# EAGLE design Low Pass Gate (EAGLE 9.2.2)
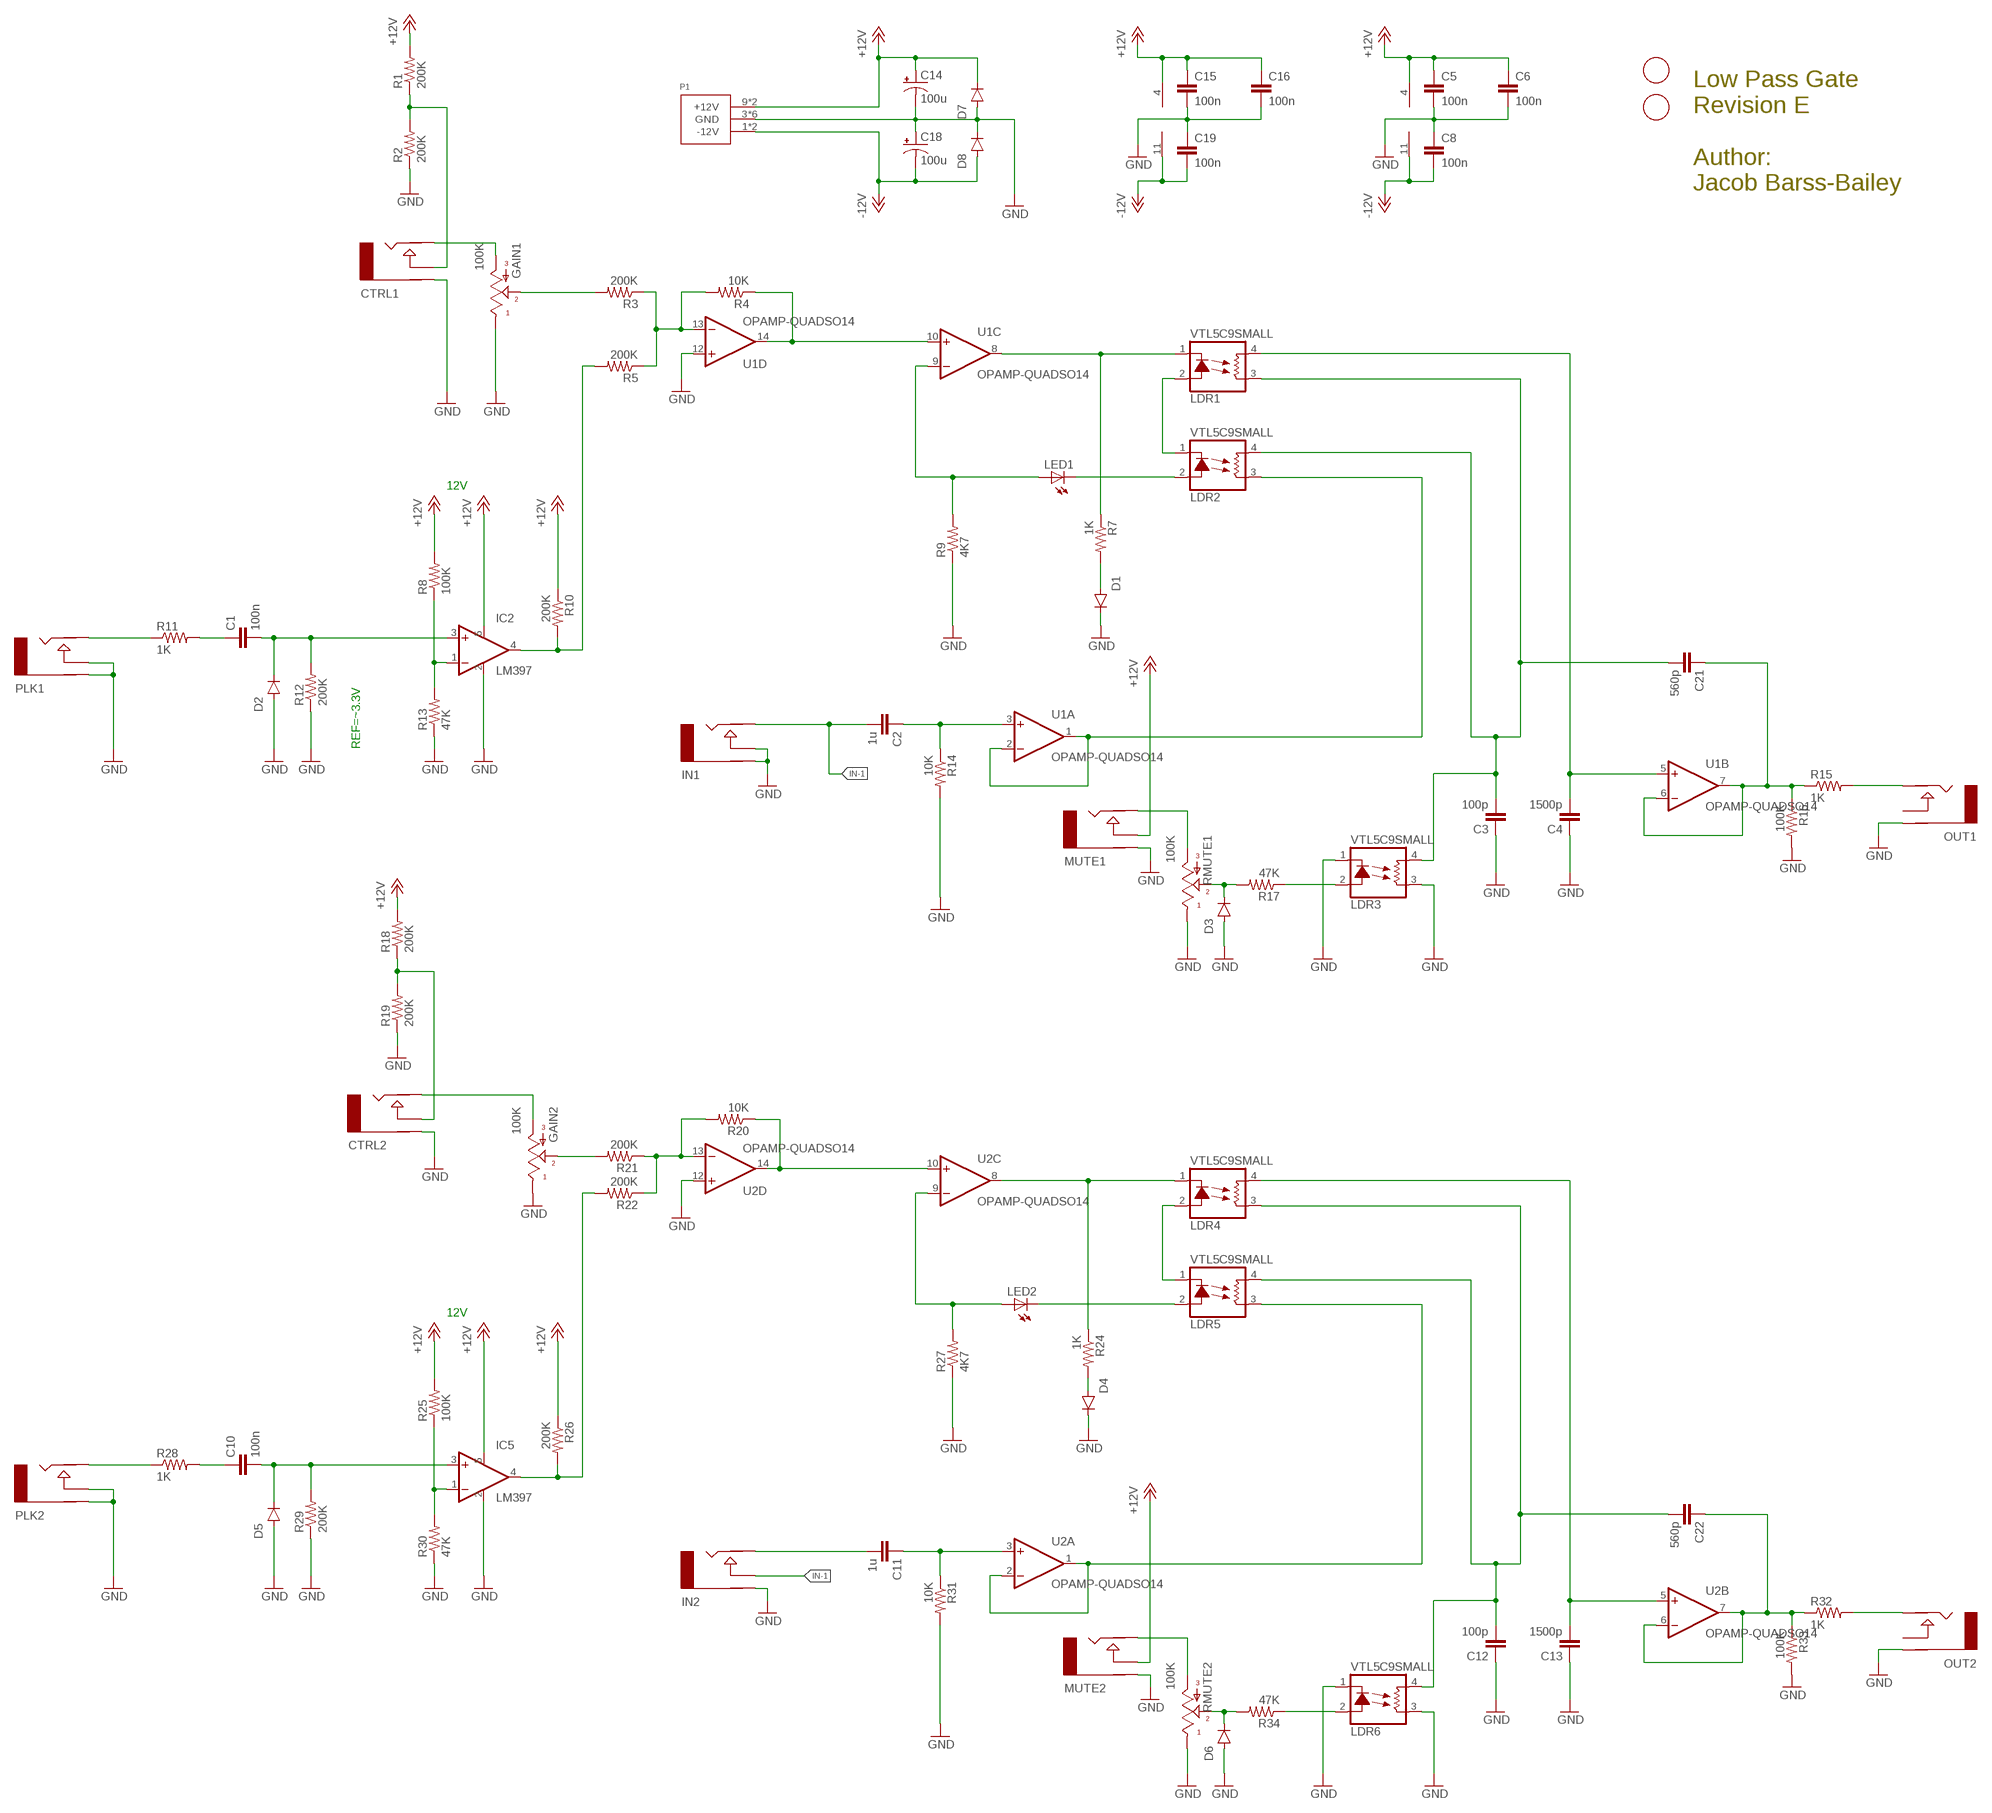
[diagram p0: schematic, sheet 1]

## Parts
C1  100n  CAP0805  [0805]
C2  1u  CAP0805  [0805]
C3  100p  CAP0805  [0805]
C4  1500p  CAP0805  [0805]
C5  100n  CAP0805  [0805]
C6  100n  CAP0805  [0805]
C8  100n  CAP0805  [0805]
C10  100n  CAP0805  [0805]
C11  1u  CAP0805  [0805]
C12  100p  CAP0805  [0805]
C13  1500p  CAP0805  [0805]
C14  100u  CAP_POLD  [PANASONIC_D]
C15  100n  CAP0805  [0805]
C16  100n  CAP0805  [0805]
C18  100u  CAP_POLD  [PANASONIC_D]
C19  100n  CAP0805  [0805]
C21  560p  CAP0805  [0805]
C22  560p  CAP0805  [0805]
CTRL1  AUDIO-JACKINLINE-FLOATGND  [ERTHENVAR-JACK-INLINE-SHAREGND550]
CTRL2  AUDIO-JACKINLINE-FLOATGND  [ERTHENVAR-JACK-INLINE-SHAREGND550]
D1  DIODE-SOD323-W  [SOD323-W]
D2  DIODE-SOD323-W  [SOD323-W]
D3  DIODE-SOD323-W  [SOD323-W]
D4  DIODE-SOD323-W  [SOD323-W]
D5  DIODE-SOD323-W  [SOD323-W]
D6  DIODE-SOD323-W  [SOD323-W]
D7  DIODE-SOD323-W  [SOD323-W]
D8  DIODE-SOD323-W  [SOD323-W]
GAIN1  100K  POTALPS-KIT  [ALPS_POT_KIT]
GAIN2  100K  POTALPS-KIT  [ALPS_POT_KIT]
IC2  LM397  [SOT23-5]
IC5  LM397  [SOT23-5]
IN1  AUDIO-JACKINLINE-FLOATGND  [ERTHENVAR-JACK-INLINE-SHAREGND550]
IN2  AUDIO-JACKINLINE-FLOATGND  [ERTHENVAR-JACK-INLINE-SHAREGND550]
LDR1  VTL5C9SMALL  [VTL5C-SMALL]
LDR2  VTL5C9SMALL  [VTL5C-SMALL]
LDR3  VTL5C9SMALL  [VTL5C-SMALL]
LDR4  VTL5C9SMALL  [VTL5C-SMALL]
LDR5  VTL5C9SMALL  [VTL5C-SMALL]
LDR6  VTL5C9SMALL  [VTL5C-SMALL]
LED1  LED3MM  [LED3MM]
LED2  LED3MM  [LED3MM]
MUTE1  AUDIO-JACKINLINE  [ERTHENVAR-JACK-INLINE]
MUTE2  AUDIO-JACKINLINE  [ERTHENVAR-JACK-INLINE]
OUT1  AUDIO-JACKINLINE  [ERTHENVAR-JACK-INLINE]
OUT2  AUDIO-JACKINLINE  [ERTHENVAR-JACK-INLINE]
P1  POWER_SIMPLE10_SHROUDED  [POWER_10_SHROUDED]
PLK1  AUDIO-JACKINLINE  [ERTHENVAR-JACK-INLINE]
PLK2  AUDIO-JACKINLINE  [ERTHENVAR-JACK-INLINE]
R1  200K  RESISTOR0603-RES  [0603-RES]
R2  200K  RESISTOR0603-RES  [0603-RES]
R3  200K  RESISTOR0603-RES  [0603-RES]
R4  10K  RESISTOR0603-RES  [0603-RES]
R5  200K  RESISTOR0603-RES  [0603-RES]
R7  1K  RESISTOR0603-RES  [0603-RES]
R8  100K  RESISTOR0603-RES  [0603-RES]
R9  4K7  RESISTOR0603-RES  [0603-RES]
R10  200K  RESISTOR0603-RES  [0603-RES]
R11  1K  RESISTOR0603-RES  [0603-RES]
R12  200K  RESISTOR0603-RES  [0603-RES]
R13  47K  RESISTOR0603-RES  [0603-RES]
R14  10K  RESISTOR0603-RES  [0603-RES]
R15  1K  RESISTOR0603-RES  [0603-RES]
R16  100K  RESISTOR0603-RES  [0603-RES]
R17  47K  RESISTOR0603-RES  [0603-RES]
R18  200K  RESISTOR0603-RES  [0603-RES]
R19  200K  RESISTOR0603-RES  [0603-RES]
R20  10K  RESISTOR0603-RES  [0603-RES]
R21  200K  RESISTOR0603-RES  [0603-RES]
R22  200K  RESISTOR0603-RES  [0603-RES]
R24  1K  RESISTOR0603-RES  [0603-RES]
R25  100K  RESISTOR0603-RES  [0603-RES]
R26  200K  RESISTOR0603-RES  [0603-RES]
R27  4K7  RESISTOR0603-RES  [0603-RES]
R28  1K  RESISTOR0603-RES  [0603-RES]
R29  200K  RESISTOR0603-RES  [0603-RES]
R30  47K  RESISTOR0603-RES  [0603-RES]
R31  10K  RESISTOR0603-RES  [0603-RES]
R32  1K  RESISTOR0603-RES  [0603-RES]
R33  100K  RESISTOR0603-RES  [0603-RES]
R34  47K  RESISTOR0603-RES  [0603-RES]
RMUTE1  100K  POTALPS-KIT  [ALPS_POT_KIT]
RMUTE2  100K  POTALPS-KIT  [ALPS_POT_KIT]
U1  OPAMP-QUADSO14  [SO14]
U2  OPAMP-QUADSO14  [SO14]
U$1  FIDUCIAL  [FIDUCIAL_1MM]
U$2  FIDUCIAL  [FIDUCIAL_1MM]

## Nets
+12V: C5.1 C6.1 C14.+ C15.1 C16.1 D7.C IC2.5(V+) IC5.5(V+) MUTE1.N(NORM) MUTE2.N(NORM) P1.9(+12V) P1.10(+12V) R1.2 R8.2 R10.1 R18.2 R25.2 R26.1 U1.4(PWR:VCC) U2.4(PWR:VCC)
-12V: C8.2 C18.- C19.2 D8.A P1.1(-12V) P1.2(-12V) U1.11(PWR:VEE) U2.11(PWR:VEE)
GND: C3.1 C4.1 C5.2 C6.2 C8.1 C12.1 C13.1 C14.- C15.2 C16.2 C18.+ C19.1 CTRL1.G(RING) CTRL2.G(RING) D1.C D2.A D3.A D4.C D5.A D6.A D7.A D8.C GAIN1.P$1(E) GAIN2.P$1(E) IC2.2(GND) IC5.2(GND) IN1.G(RING) IN1.N(NORM) IN2.G(RING) LDR3.1(C) LDR3.3(L1) LDR6.1(C) LDR6.3(L1) MUTE1.G(RING) MUTE2.G(RING) OUT1.G(RING) OUT2.G(RING) P1.3(GND) P1.4(GND) P1.5(GND) P1.6(GND) P1.7(GND) P1.8(GND) PLK1.G(RING) PLK1.N(NORM) PLK2.G(RING) PLK2.N(NORM) R2.1 R9.1 R12.1 R13.1 R14.2 R16.2 R19.1 R27.1 R29.1 R30.1 R31.2 R33.2 RMUTE1.P$1(E) RMUTE2.P$1(E) U1.12(D:+IN) U2.12(D:+IN)
IN-1: C2.2 IN1.T(TIP) IN2.N(NORM)
N$1: R20.2 R21.1 R22.1 U2.13(D:-IN)
N$2: LDR4.1(C) R24.1 U2.8(C:OUT)
N$3: LDR4.2(A) LDR5.1(C)
N$5: GAIN2.P$2(S) R21.2
N$6: LED2.A R27.2 U2.9(C:-IN)
N$7: LDR5.2(A) LED2.K(C)
N$8: CTRL2.N(NORM) R18.1 R19.2
N$9: CTRL1.T(TIP) GAIN1.P$3(A)
N$10: D4.A R24.2
N$11: CTRL2.T(TIP) GAIN2.P$3(A)
N$12: PLK2.T(TIP) R28.1
N$13: C11.2 IN2.T(TIP)
N$14: IC5.4(OUT) R22.2 R26.2
N$15: C10.2 D5.C IC5.3(+IN) R29.2
N$16: C10.1 R28.2
N$17: IC5.1(-IN) R25.1 R30.2
N$18: R3.1 R4.2 R5.1 U1.13(D:-IN)
N$20: CTRL1.N(NORM) R1.1 R2.2
N$21: IC2.4(OUT) R5.2 R10.2
N$22: D6.C R34.2 RMUTE2.P$2(S)
N$23: OUT2.T(TIP) R32.2
N$24: C11.1 R31.1 U2.3(A:+IN)
N$25: C13.2 LDR4.4(L2) U2.5(B:+IN)
N$26: C1.2 D2.C IC2.3(+IN) R12.2
N$27: LDR5.3(L1) U2.1(A:OUT) U2.2(A:-IN)
N$28: C22.1 R32.1 R33.1 U2.6(B:-IN) U2.7(B:OUT)
N$29: C1.1 R11.2
N$30: LDR6.2(A) R34.1
N$31: C12.2 C22.2 LDR4.3(L1) LDR5.4(L2) LDR6.4(L2)
N$32: IC2.1(-IN) R8.1 R13.2
N$33: PLK1.T(TIP) R11.1
N$34: MUTE2.T(TIP) RMUTE2.P$3(A)
N$35: D1.A R7.2
N$39: OUT1.T(TIP) R15.2
N$40: C2.1 R14.1 U1.3(A:+IN)
N$41: C4.2 LDR1.4(L2) U1.5(B:+IN)
N$42: LDR2.3(L1) U1.1(A:OUT) U1.2(A:-IN)
N$43: C21.1 R15.1 R16.1 U1.6(B:-IN) U1.7(B:OUT)
N$44: C3.2 C21.2 LDR1.3(L1) LDR2.4(L2) LDR3.4(L2)
N$45: MUTE1.T(TIP) RMUTE1.P$3(A)
N$46: LDR3.2(A) R17.1
N$47: LDR2.2(A) LED1.K(C)
N$48: LDR1.1(C) R7.1 U1.8(C:OUT)
N$49: LDR1.2(A) LDR2.1(C)
N$50: D3.C R17.2 RMUTE1.P$2(S)
N$51: GAIN1.P$2(S) R3.2
N$53: LED1.A R9.2 U1.9(C:-IN)
VSIG: R20.1 U2.10(C:+IN) U2.14(D:OUT)
VSIG1: R4.1 U1.10(C:+IN) U1.14(D:OUT)
Unconnected: OUT1.N(NORM) OUT2.N(NORM)

## Notes on the sheet
- Low Pass Gate
  Revision E
  
  Author:
  Jacob Barss-Bailey
- 12V
- REF=~3.3V
- 12V

## Library data of the parts
C1-C6 C8 C10-C13 C15 C16 C19 C21 C22 = SparkFun-Passives:CAP: Capacitor Standard 0603 ceramic capacitor, and 0.1" leaded capacitor.
C14 C18 = SparkFun-Passives:CAP_POL: Capacitor Polarized These are standard SMD and PTH capacitors. Normally 10uF, 47uF, and 100uF in electrolytic and tantalum varieties. Always verify the external diameter of the through hole cap, it varies with capacity, voltage, and manufacturer. The EIA devices should be standard.
CTRL1 CTRL2 IN1 IN2 MUTE1 MUTE2 OUT1 OUT2 PLK1 PLK2 = erthenvar:AUDIO-JACK: Switching Mono 3.5mm Audio Jack from Erthenvar. Horizontal package.
D1-D8 = diode:DIODE-: DIODE
GAIN1 GAIN2 RMUTE1 RMUTE2 = SparkFun-Electromechanical:POT; PROD_ID: RES-09177
IC2 IC5 = barsstronics:LM397: 7 Single General-Purpose Voltage Comparator
LDR1-LDR6 = optocoupler:VTL5C*: Low Cost Axial Vactrols Source: www.perkinelmer.com/opto ... vtl5c9_c10.pdf; MF: VACTEC PHOTO; MPN: VTL5C9; OC_FARNELL: 2067857; OC_NEWARK: 95F9033
LED1 LED2 = adafruit:LED: LED OSRAM: - CHIPLED LG R971, LG N971, LY N971, LG Q971, LY Q971, LO R971, LY R971 LH N974, LH R974 LS Q976, LO Q976, LY Q976 LO Q996 - Hyper CHIPLED LW Q18S LB Q993, LB Q99A, LB R99A - SideLED LS A670, LO A670, LY A670, LG A670, LP A670 LB A673, LV A673, LT A673, LW A673 LH A674 LY A675 LS A676, LA A676, LO A676, LY A676, LW A676 LS A679, LY A679, LG A679 - Hyper Micro SIDELED® LS Y876, LA Y876, LO Y876, LY Y876 LT Y87S - SmartLED LW L88C, LW L88S LB L89C, LB L89S, LG L890 LS L89K, LO L89K, LY L89K LS L896, LA L896, LO L896, LY L896 - TOPLED LS T670, LO T670, LY T670, LG T670, LP T670 LSG T670, LSP T670, LSY T670, LOP T670, LYG T670 LG T671, LOG T671, LSG T671 LB T673, LV T673, LT T673, LW T673 LH T674 LS T676, LA T676, LO T676, LY T676, LB T676, LH T676, LSB T676, LW T676 LB T67C, LV T67C, LT T67C, LS T67K, LO T67K, LY T67K, LW E67C LS E67B, LA E67B, LO E67B, LY E67B, LB E67C, LV E67C, LT E67C LW T67C LS T679, LY T679, LG T679 LS T770, LO T770, LY T770, LG T770, LP T770 LB T773, LV T773, LT T773, LW T773 LH T774 LS E675, LA E675, LY E675, LS T675 LS T776, LA T776, LO T776, LY T776, LB T776 LHGB T686 LT T68C, LB T68C - Hyper Mini TOPLED® LB M676 - Mini TOPLED Santana® LG M470 LS M47K, LO M47K, LY M47K Source: http://www.osram.convergy.de/
P1 = eurorack:POWER_SIMPLE
R1-R5 R7-R22 R24-R34 = SparkFun-Passives:RESISTOR: Resistor Basic schematic elements and footprints for 0603, 1206, and PTH resistors.
U1 U2 = barsstronics:OPAMP-QUAD
U$1 U$2 = adafruit:FIDUCIAL: For use by pick and place machines to calibrate the vision/machine, 1mm By microbuilder.eu

## Board
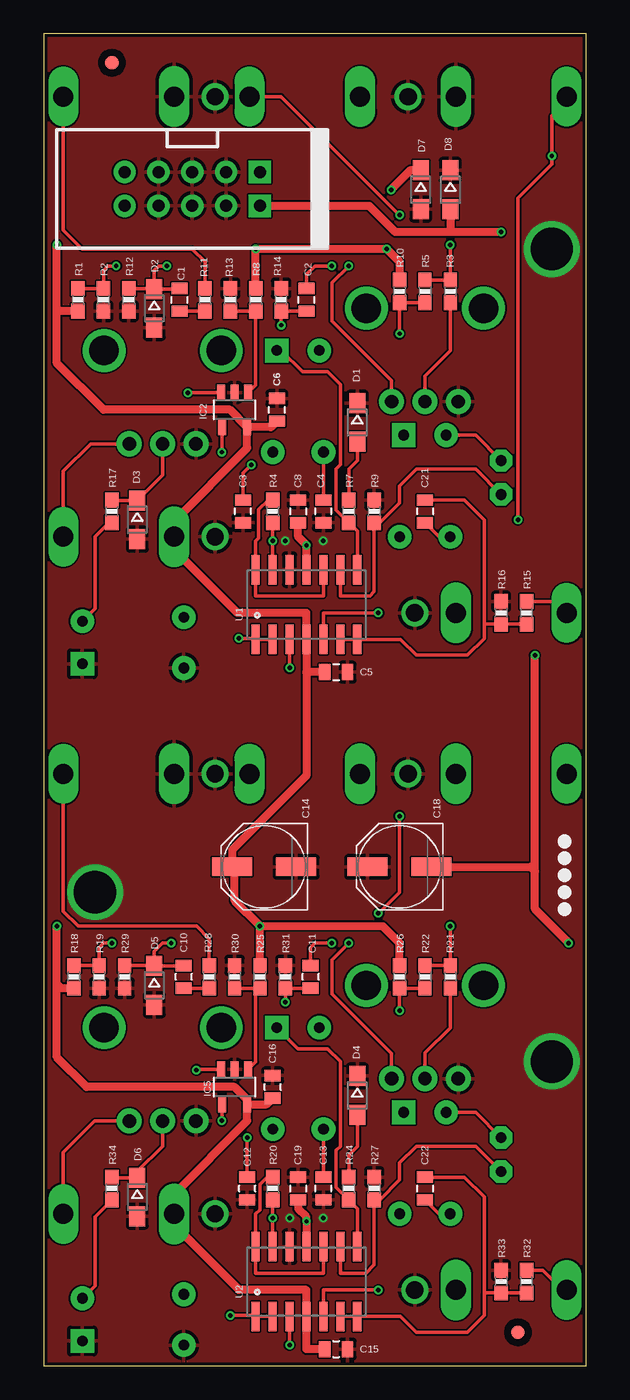
[diagram p1: board, top side]
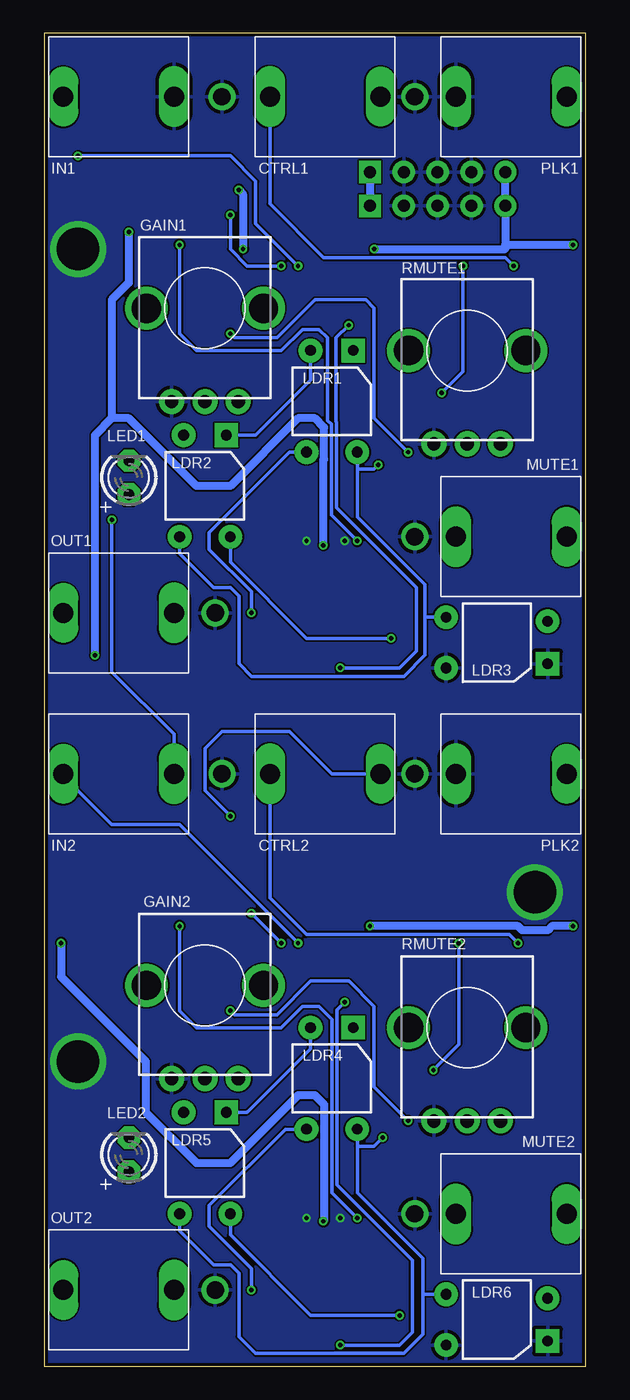
[diagram p2: board, bottom side, seen from below]

Size 40.64 x 100 mm. Coordinates in mm from the lower left corner, seen from the top.
Outline: 40.64,0 0,0 0,100 40.64,100 40.64,0
Copper layers (1*16): Top 0.035mm / dielectric 1.5mm / Bottom 0.035mm
Design rules "dirt_cheap_dirty_boards.v1": minimum track width 5mil, minimum drill 12mil, track to track 5mil, track to pad 5mil, pad to pad 5mil, via to via 5mil, smd to smd 0mil, copper to edge 10mil, drill to drill 10mil, minimum pad ring 10mil, minimum via ring 6mil, stop-mask expansion 2mil, vias tented up to drill 25mil, thermal gap 10mil

### Footprints (pad centres in the part's own frame; a part is rotated, then mirrored left to right if it is on the bottom)
0805 = smd 0.851 x 1.2: 1 -0.849,0; 2 0.849,0
PANASONIC_D = smd 3 x 1.4: + 2.4,0; - -2.4,0
ERTHENVAR-JACK-INLINE-SHAREGND550 = drill 1.3 pad 2.032: G 0,-6.985 | drill 1.5 pad 2.286 long: N 0,-3.38 | drill 1.5 pad 2.235 long: T 0,4.92
SOD323-W = smd 1.5 x 1.2: A 1.45,0; C -1.45,0
ALPS_POT_KIT = drill 1 pad 1.88: P$1 7,-2.5; P$2 7,0; P$3 7,2.5 | drill 2.2: P$4 0,-4.4; P$5 0,4.4
SOT23-5 = smd 0.6 x 1.2: 1 -1.026,-1.306; 2 0,-1.306; 3 1.026,-1.306; 4 0.95,1.306; 5 -0.95,1.306
VTL5C-SMALL = drill 0.8 pad 1.778 square: 1 -3.81,1.6 | drill 0.8 pad 1.778: 2 -3.81,-1.6; 3 3.81,1.905; 4 3.81,-1.905
LED3MM = drill 0.813 pad 1.676 octagon: A -1.27,0; K 1.27,0
ERTHENVAR-JACK-INLINE = drill 1.3 pad 2.032: G 0,-6.48 | drill 1.5 pad 2.286 long: N 0,-3.38 | drill 1.5 pad 2.235 long: T 0,4.92
POWER_10_SHROUDED = drill 0.9 pad 1.676 square: 1 -5.08,-1.27; 2 -5.08,1.27 | drill 0.9 pad 1.676: 3 -2.54,-1.27; 4 -2.54,1.27; 5 0,-1.27; 6 0,1.27; 7 2.54,-1.27; 8 2.54,1.27; 9 5.08,-1.27; 10 5.08,1.27
0603-RES = smd 1.1 x 1: 1 -0.85,0; 2 0.85,0
SO14 = smd 0.61 x 2.21: 1 -3.175,-2.616; 2 -1.905,-2.616; 3 -0.635,-2.616; 4 0.635,-2.616; 5 1.905,-2.616; 6 3.175,-2.616; 7 4.445,-2.616; 8 4.445,2.616; 9 3.175,2.616; 10 1.905,2.616; 11 0.635,2.616; 12 -0.635,2.616; 13 -1.905,2.616; 14 -3.175,2.616
FIDUCIAL_1MM = smd 1 x 1: 1 0,0

### Placement (x,y rotation side)
C1  10.16,80.01 90 top
C2  19.68,80.01 90 top
C3  14.92,64.14 90 top
C4  20.95,64.14 90 top
C5  21.91,52.07 0 top
C6  17.46,71.75 90 top
C8  19.05,64.14 270 top
C10  10.48,29.21 90 top
C11  20,29.21 90 top
C12  15.24,13.34 90 top
C13  20.95,13.34 90 top
C14  16.51,37.47 180 top
C15  21.91,1.27 0 top
C16  17.14,20.95 90 top
C18  26.67,37.47 180 top
C19  19.05,13.34 270 top
C21  28.57,64.14 270 top
C22  28.57,13.34 270 top
CTRL1  20.32,95.25 270 bottom
CTRL2  20.32,44.45 270 bottom
D1  23.5,70.8 270 top
D2  8.26,79.38 270 top
D3  6.99,63.5 270 top
D4  23.5,20.32 270 top
D5  8.26,28.57 270 top
D6  6.99,12.7 270 top
D7  28.26,88.27 270 top
D8  30.48,88.27 270 top
GAIN1  28.57,79.38 270 bottom
GAIN2  28.57,28.57 270 bottom
IC2  14.29,71.75 180 top
IC5  14.29,20.95 180 top
IN1  34.29,95.25 90 bottom
IN2  34.29,44.45 90 bottom
LDR1  19.05,72.39 270 bottom
LDR2  28.57,66.04 270 bottom
LDR3  6.67,54.29 180 bottom
LDR4  19.05,21.59 270 bottom
LDR5  28.57,15.24 270 bottom
LDR6  6.67,3.49 180 bottom
LED1  34.29,66.67 90 bottom
LED2  34.29,15.88 90 bottom
MUTE1  6.35,62.23 270 bottom
MUTE2  6.35,11.43 270 bottom
OUT1  34.29,56.52 90 bottom
OUT2  34.29,5.71 90 bottom
P1  11.11,88.33 180 top
PLK1  6.35,95.25 270 bottom
PLK2  6.35,44.45 270 bottom
R1  2.54,80.01 270 top
R2  4.45,80.01 90 top
R3  30.48,80.64 270 top
R4  17.14,64.14 270 top
R5  28.57,80.64 270 top
R7  22.86,64.14 90 top
R8  15.88,80.01 90 top
R9  24.77,64.14 270 top
R10  26.67,80.64 270 top
R11  12.06,80.01 270 top
R12  6.35,80.01 90 top
R13  13.97,80.01 270 top
R14  17.78,80.01 90 top
R15  36.2,56.52 90 top
R16  34.29,56.52 90 top
R17  5.08,64.14 90 top
R18  2.22,29.21 270 top
R19  4.13,29.21 90 top
R20  17.14,13.34 270 top
R21  30.48,29.21 270 top
R22  28.57,29.21 270 top
R24  22.86,13.34 90 top
R25  16.19,29.21 90 top
R26  26.67,29.21 270 top
R27  24.77,13.34 270 top
R28  12.38,29.21 270 top
R29  6.03,29.21 90 top
R30  14.29,29.21 270 top
R31  18.1,29.21 90 top
R32  36.2,6.35 90 top
R33  34.29,6.35 90 top
R34  5.08,13.34 90 top
RMUTE1  8.89,76.2 270 bottom
RMUTE2  8.89,25.4 270 bottom
U1  19.05,57.15 0 top
U2  19.05,6.35 0 top
U$1  35.56,2.54 0 top
U$2  5.08,97.79 0 top

### Tracks (layer width: path | path; a pad name or v marks a point on that pad's centre or on a via)
+12V  (via drill 0.33)
  Top 0.61: C15.1 19.68,1.27 U2.4 19.68,5.71 14.61,5.71 9.73,10.59 MUTE2.N 9.73,12.9 15.24,18.41 IC5.5 | R18.2 1.27,28.36 0.95,28.68 | IC5.5 16.69,19.65 C16.1 | IC5.5 15.24,20 14.29,20.95 3.17,20.95 0.95,23.18 0.95,28.68 | R25.2 v16.19,33.02 | v16.19,33.02 25.4,33.02 26.67,31.75 R26.1 | 19.68,52.07 U1.4 19.68,56.52 14.49,56.52 9.73,61.28 MUTE1.N 9.73,63.39 15.24,68.9 IC2.5 | 0.95,28.68 v0.95,33.02 | C6.1 17.01,70.45 IC2.5 | IC2.5 13.93,71.75 4.45,71.75 0.95,75.25 0.95,79.38 | R1.2 1.17,79.16 0.95,79.38 | R8.2 v15.88,83.82 v25.72,83.82 26.67,82.87 R10.1 | 0.95,79.38 v0.95,84.14 | C5.1 19.68,52.07 | D7.C 27.48,89.72 v26.04,88.27 | v16.19,33.02 14.29,34.92 14.29,37.29 C14.+ 14.11,38.73 19.68,44.31 19.68,52.07
  Bottom 0.61: v0.95,33.02 2.54,33.02 2.86,32.7 4.76,32.7 5.08,33.02 v16.19,33.02 | 6.03,84.14 v0.95,84.14 | v15.88,83.82 6.03,83.82 6.03,84.14 | 6.03,84.14 P1.10 P1.9 | v26.04,88.27 25.72,87.95 v25.72,83.82
-12V  (via drill 0.33)
  Top 0.61: C19.2 19.05,11.82 19.68,11.19 v19.68,10.87 U2.11 | U1.11 v19.68,61.59 19.05,62.23 C8.2 | v34.29,85.09 30.48,85.09 | 30.48,85.09 26.35,85.09 24.38,87.06 P1.2 | D8.A 30.48,85.09 | 36.83,37.15 36.51,37.47 C18.- | v39.37,31.75 36.83,34.29 36.83,37.15 | 36.83,37.15 v36.83,53.34
  Bottom 0.61: v19.68,10.87 19.61,10.95 19.61,19.61 20.32,20.32 21.59,20.32 26.67,15.24 29.21,15.24 33.02,19.05 33.02,22.86 39.37,29.21 v39.37,31.75 | P1.1 P1.2 | 35.56,71.12 36.83,69.85 v36.83,53.34 | v19.68,61.59 19.68,67.98 19.63,68.03 19.63,70.43 20.32,71.12 21.59,71.12 26.67,66.04 29.21,66.04 34.29,71.12 35.56,71.12 | v34.29,85.09 34.29,81.28 35.56,80.01 35.56,71.12
GND  (via drill 0.33, 3.17 pad 4.06)
  other vias: 18.41,11.11 20.95,11.11 18.1,61.91 20.95,61.91 38.1,22.86 38.1,83.82 3.81,35.56
  pour Bottom: 40.64,100 40.64,0 0,0 0,100
  pour Top: 40.64,100 40.64,0 0,0 0,100
IN-1  (via drill 0.33)
  Top 0.254: IN1.T 39.21,94.93 38.1,93.82 v38.1,90.81 38.1,90.17 35.56,87.63 v35.56,63.5 | v21.59,82.55 20.32,82.55 19.68,81.92 C2.2
  Bottom 0.254: v35.56,63.5 35.56,52.07 30.91,47.42 IN2.N | v21.59,82.55 24.77,85.72 24.77,88.9 26.67,90.81 v38.1,90.81
N$1  (via drill 0.33)
  Top 0.254: R22.1 R21.1 v30.48,33.02 | U2.13 v17.14,11.11 R20.2
  Bottom 0.254: v17.14,11.11 19.05,13.02 19.05,26.04 20,26.99 21.27,26.99 22.86,25.4 29.21,25.4 30.48,26.67 v30.48,33.02
N$2
  Top 0.254: U2.8 23.5,11.82 23.18,12.14 23.18,12.17 R24.1 21.91,13.44 21.91,16.19 22.23,16.51 22.23,22.86 21.27,23.81 19.04,23.81 LDR4.1
N$3
  Bottom 0.254: LDR5.1 25.4,19.05 20.65,23.8 LDR4.2
N$5
  Top 0.254: GAIN2.P$2 28.57,23.5 30.48,25.4 R21.2
N$6
  Top 0.254: LED2.A 32.38,16.51 27.94,16.51 26.67,15.24 26.67,13.97 25.18,12.48 R27.2 24.77,7.62 24.13,6.99 22.23,6.99 U2.9
N$7
  Top 0.254: LDR5.2 32.38,19.05 LED2.K
N$8  (via drill 0.33)
  Top 0.254: R18.1 R19.2 4.13,31.43 4.45,31.75 v5.08,31.75
  Bottom 0.254: v5.08,31.75 5.71,32.38 20.95,32.38 23.7,35.13 CTRL2.N
N$9  (via drill 0.33)
  Top 0.254: GAIN1.P$3 26.07,73.94 21.59,78.42 21.59,81.28 v22.86,82.55 | v26.67,86.36 17.78,95.25 CTRL1.T
  Bottom 0.254: v26.67,86.36 26.67,83.82 25.4,82.55 v22.86,82.55
N$10
  Top 0.254: R24.2 22.86,15.88 23.5,16.51 D4.A
N$11  (via drill 0.33)
  Top 0.254: GAIN2.P$3 26.07,23.45 21.59,27.94 21.59,30.48 v22.86,31.75 | v26.67,41.27 26.67,35.56 v25.08,33.97
  Bottom 0.254: v22.86,31.75 v25.08,33.97 | CTRL2.T 19.05,44.45 22.23,47.62 27.3,47.62 28.57,46.35 28.57,43.18 v26.67,41.27
N$12
  Top 0.254: PLK2.T 1.43,34.13 2.54,33.02 11.43,33.02 12.38,32.07 R28.1
N$13  (via drill 0.33)
  Top 0.254: C11.2 20,31.43 20.32,31.75 v21.59,31.75
  Bottom 0.254: v21.59,31.75 30.48,40.64 35.56,40.64 39.21,44.29 IN2.T
N$14  (via drill 0.33)
  Top 0.254: R22.2 R26.2 v26.67,26.67 | IC5.4 v13.34,18.41
  Bottom 0.254: v13.34,18.41 15.88,20.95 15.88,26.99 17.78,28.89 20.64,28.89 23.18,26.35 26.35,26.35 v26.67,26.67
N$15  (via drill 0.33)
  Top 0.254: R29.2 8.22,30.06 D5.C | D5.C 10.44,30.02 C10.2 | D5.C 8.26,31.11 8.89,31.75 v9.53,31.75 | v11.43,22.23 11.47,22.26 IC5.3
  Bottom 0.254: v9.53,31.75 9.53,24.13 v11.43,22.23
N$16
  Top 0.254: C10.1 R28.2
N$17
  Top 0.254: R30.2 R25.1 15.98,28.36 15.88,28.26 15.88,22.82 IC5.1
N$18  (via drill 0.33)
  Top 0.254: R5.1 R3.1 v30.48,84.14 | R4.2 v17.14,61.91 U1.13
  Bottom 0.254: v30.48,84.14 30.48,77.47 29.21,76.2 22.86,76.2 21.27,77.79 20,77.79 19.37,77.15 19.37,70.96 19.07,70.67 19.07,63.84 v17.14,61.91
N$20  (via drill 0.33)
  Top 0.254: R1.1 R2.2 4.45,82.23 4.76,82.55 v5.4,82.55
  Bottom 0.254: CTRL1.N 23.7,87.2 19.68,83.19 6.03,83.19 v5.4,82.55
N$21  (via drill 0.33)
  Top 0.254: R5.2 R10.2 v26.67,77.47 | v13.34,68.58 IC2.4
  Bottom 0.254: v26.67,77.47 26.35,77.15 23.18,77.15 20.32,80.01 16.51,80.01 15.88,79.38 15.88,71.12 v13.34,68.58
N$22
  Top 0.254: R34.2 5.12,14.15 D6.C 6.99,14.61 8.89,16.51 RMUTE2.P$2
N$23
  Top 0.254: OUT2.T 38.89,5.71 37.41,7.2 R32.2
N$24  (via drill 0.33)
  Top 0.254: U2.3 v18.41,1.59 | C11.1 R31.1 v18.1,27.3
  Bottom 0.254: v18.41,1.59 13.97,1.59 13.02,2.54 13.02,7.94 18.67,13.59 18.67,26.73 v18.1,27.3
N$25  (via drill 0.33)
  Top 0.254: C13.2 LDR4.4 | U2.5 20.95,5.71 v25.08,5.71
  Bottom 0.254: v25.08,5.71 25.08,7.3 28.26,10.48 28.26,12.06 22.54,17.78 LDR4.4
N$26  (via drill 0.33)
  Top 0.254: R12.2 8.22,80.86 D2.C | D2.C 10.13,80.83 C1.2 | D2.C 8.26,82.23 8.57,82.55 v9.21,82.55 | v10.79,73.03 10.83,73.06 IC2.3
  Bottom 0.254: v9.21,82.55 9.21,74.61 v10.79,73.03
N$27  (via drill 0.33)
  Top 0.254: U2.2 U2.1 15.8,3.81 v13.97,3.81
  Bottom 0.254: LDR5.3 26.67,9.84 20.64,3.81 v13.97,3.81
N$28
  Top 0.254: U2.6 U2.7 26.75,3.73 27.94,2.54 31.75,2.54 33.02,3.81 33.02,5.4 | R32.1 R33.1 33.12,5.5 33.02,5.4 | 33.02,5.4 33.02,12.7 31.54,14.18 C22.1
N$29
  Top 0.254: R11.2 C1.1
N$30
  Top 0.254: R34.1 3.81,11.21 3.81,6.04 LDR6.2
N$31  (via drill 0.33)
  Top 0.254: C22.2 29.63,11.43 LDR5.4 | C12.2 v15.24,17.14
  Bottom 0.254: LDR5.4 30.48,10.16 27.94,7.62 26.67,7.62 26.04,6.99 26.04,2.22 24.77,0.95 13.65,0.95 12.22,2.38 12.22,5.4 | 12.22,5.4 12.22,8.1 17.14,13.02 17.14,16.51 | LDR6.4 12.22,5.4 | LDR4.3 17.14,16.51 | v15.24,17.14 15.88,16.51 17.14,16.51
N$32
  Top 0.254: R13.2 R8.1 15.88,73.62 IC2.1
N$33
  Top 0.254: R11.1 12.06,82.87 11.11,83.82 2.86,83.82 1.43,85.25 PLK1.T
N$34
  Top 0.254: MUTE2.T 1.43,16.04 3.79,18.4 RMUTE2.P$3
N$35
  Top 0.254: D1.A 23.5,67.94 22.86,67.31 R7.2
N$39
  Top 0.254: R15.2 38.36,57.37 OUT1.T
N$40  (via drill 0.33)
  Top 0.254: C2.1 R14.1 v17.78,78.11 | U1.3 v18.41,52.39
  Bottom 0.254: v17.78,78.11 18.73,77.15 18.73,70.86 18.69,70.82 18.69,64.41 12.7,58.42 12.7,53.66 13.97,52.39 v18.41,52.39
N$41  (via drill 0.33)
  Top 0.254: LDR1.4 C4.2 | U1.5 20.95,56.52 v25.08,56.52
  Bottom 0.254: v25.08,56.52 25.08,58.1 28.26,61.28 28.26,62.55 22.23,68.58 LDR1.4
N$42  (via drill 0.33)
  Top 0.254: U1.2 U1.1 15.8,54.61 v14.61,54.61
  Bottom 0.254: v14.61,54.61 20.95,54.61 26.67,60.33 LDR2.3
N$43
  Top 0.254: R15.1 R16.1 33.12,55.66 33.02,55.56 | U1.6 U1.7 26.75,54.53 27.94,53.34 31.75,53.34 33.02,54.61 33.02,55.56 | 33.02,55.56 33.02,63.5 31.54,64.98 C21.1
N$44  (via drill 0.33)
  Top 0.254: C21.2 29.63,62.23 LDR2.4 | v15.56,67.63 14.92,66.99 C3.2
  Bottom 0.254: LDR2.4 30.48,60.96 27.94,58.42 26.67,58.42 26.04,57.78 26.04,52.7 25.08,51.75 13.65,51.75 12.06,53.34 12.06,56.2 | 17.14,67.31 17.14,63.72 12.06,58.64 12.06,56.2 | 17.14,67.31 LDR1.3 | LDR3.4 12.06,56.2 | 17.14,67.31 15.88,67.31 v15.56,67.63
N$45
  Top 0.254: RMUTE1.P$3 3.48,69.2 1.43,67.15 MUTE1.T
N$46
  Top 0.254: R17.1 4.87,63.28 3.81,62.23 3.81,56.84 LDR3.2
N$47
  Top 0.254: LED1.K 32.38,69.85 LDR2.2
N$48
  Top 0.254: LDR1.1 17.78,76.2 19.37,74.61 21.27,74.61 22.23,73.66 22.23,67.63 21.91,67.31 21.91,64.24 R7.1 23.5,62.65 U1.8
N$49
  Bottom 0.254: LDR2.1 24.77,69.85 20.64,73.98 20.65,73.99 LDR1.2
N$50
  Top 0.254: R17.2 5.12,64.95 D3.C 8.89,66.86 RMUTE1.P$2
N$51
  Top 0.254: R3.2 30.48,76.2 28.57,74.3 GAIN1.P$2
N$53
  Top 0.254: LED1.A 32.38,67.31 27.94,67.31 26.67,66.04 26.67,64.77 25.18,63.28 R9.2 24.77,58.1 24.45,57.78 22.23,57.78 U1.9
VSIG
  Top 0.254: U2.10 20.95,6.99 15.88,6.99 U2.14 15.88,11.43 16.19,11.75 16.19,13.65 16.73,14.19 R20.1
VSIG1
  Top 0.254: U1.10 20.95,57.78 15.88,57.78 U1.14 15.88,61.9 16.09,62.12 16.09,64.25 16.83,64.98 R4.1

### Text on the board
tValues: 100K
tStop: 2019.07.18 | LPG rev E | INTERNATIONAL KNITTING